# Altium schematic sheet Project_Node_Sensors.SchDoc: Principal Node_Sensor Schematic
size A; Date: 10/08/2024; Author: Prudhvi Kondapalli; CompanyName: CU Boulder; DrawnBy: Project_Vega_Team; Engineer: Prudhvi Kondapalli; DocumentNumber: 1; Revision: 1; SheetNumber: 5; SheetTotal: 7
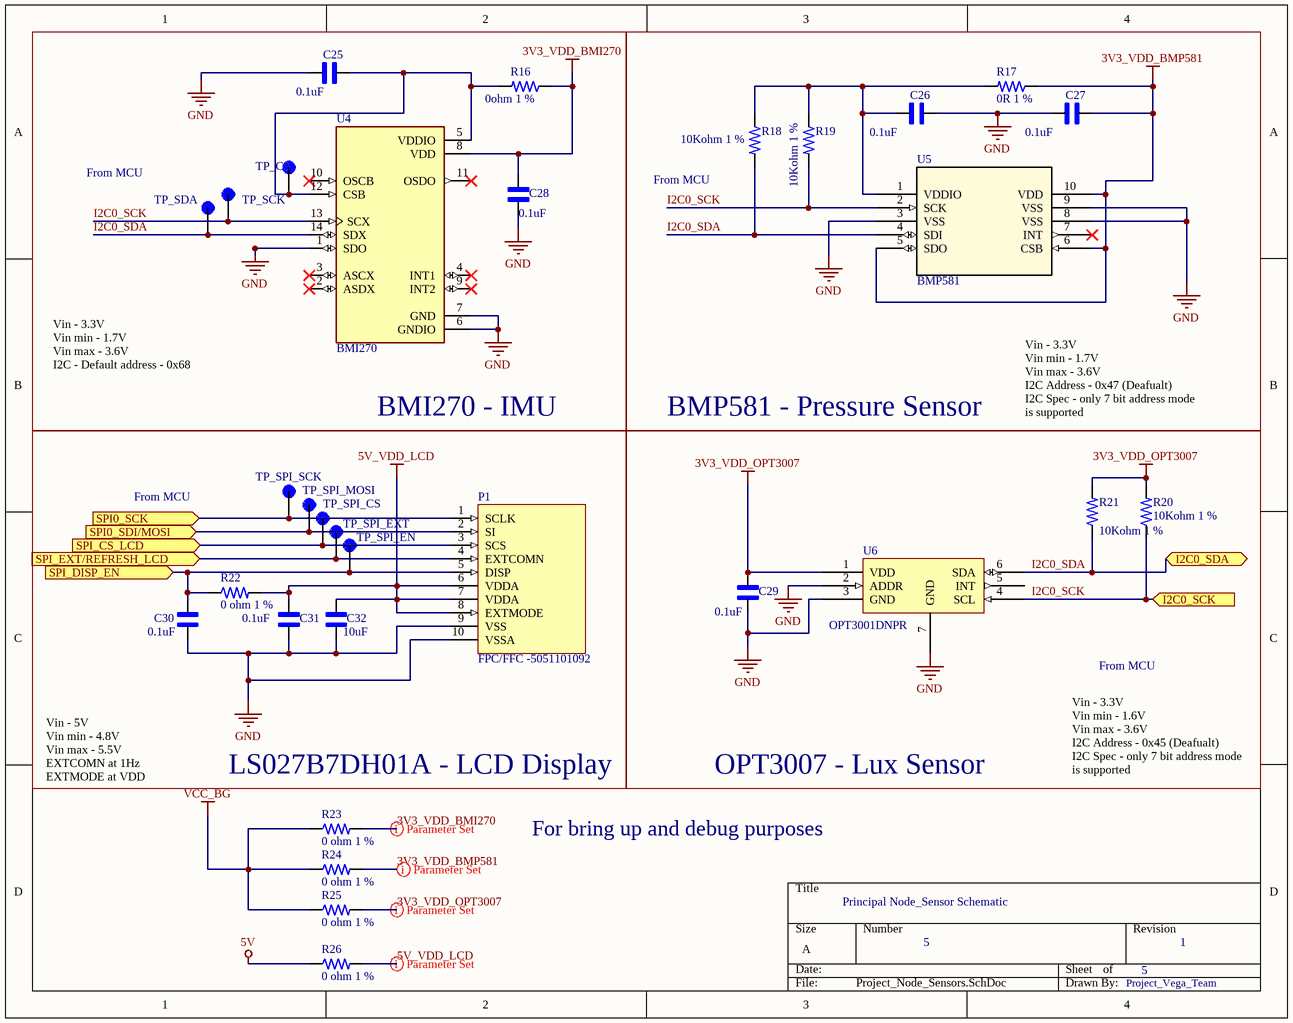
[diagram p0: Project_Node_Sensors.SchDoc]

## Parts
C25  0.1uF  [CAPC1608X90]
C26  0.1uF  [CAPC1608X90]
C27  0.1uF  [CAPC1608X90]
C28  0.1uF  [CAPC1608X90]
C29  0.1uF  [CAPC1608X90]
C30  0.1uF  [CAPC1608X90]
C31  0.1uF  [CAPC1608X90]
C32  10uF  [CAPC1608X90]
P1  FPC/FFC -5051101092  [CON_5051101092_MOL]
R16  0ohm 1 %  [RES_0603_1608X06]
R17  0R 1 %  [RES_0603_1608X06]
R18  10Kohm 1 %  [RES_0603_1608X06]
R19  10Kohm 1 %  [RES_0603_1608X06]
R20  10Kohm 1 %  [RES_0603_1608X06]
R21  10Kohm 1 %  [RES_0603_1608X06]
R22  0 ohm 1 %  [RES_0603_1608X06]
R23  0 ohm 1 %  [RES_0603_1608X06]
R24  0 ohm 1 %  [RES_0603_1608X06]
R25  0 ohm 1 %  [RES_0603_1608X06]
R26  0 ohm 1 %  [RES_0603_1608X06]
TP_CS  Test_point  [1]  (value not drawn)
TP_SCK  Test_point  [1]  (value not drawn)
TP_SDA  Test_point  [1]  (value not drawn)
TP_SPI_CS  Test_point  [1]  (value not drawn)
TP_SPI_EN  Test_point  [1]  (value not drawn)
TP_SPI_EXT  Test_point  [1]  (value not drawn)
TP_SPI_MOSI  Test_point  [1]  (value not drawn)
TP_SPI_SCK  Test_point  [1]  (value not drawn)
U4  BMI270  [XDCR_BMI270]
U5  BMP581  [QFN10_BMP581_BOS-M]
U6  OPT3001DNPR  [OPT3001-SON127P600-8N]

## Blocks framed on the sheet
BMI270 - IMU: C25 C28 R16 TP_CS TP_SCK TP_SDA U4
BMP581 - Pressure Sensor: C26 C27 R17-R19 U5

## Ports
I2C0_SCK (in, see Principal_Node[2C]), I2C0_SDA (bidir, see Principal_Node[2C]), SPI0_SCK (in, see Principal_Node[2D]), SPI0_SDI/MOSI (in, see Principal_Node[2D]), SPI_CS_LCD (in, see Principal_Node[2D]), SPI_DISP_EN (in, see Principal_Node[2C]), SPI_EXT/REFRESH_LCD (in, see Principal_Node[2C])

## Nets
3V3_VDD_BMI270: C28.1 R16.1 R23.2 U4.8(VDD)
3V3_VDD_BMP581: C27.2 R17.1 R24.2 U5.5(SDO) U5.6(CSB) U5.10(VDD)
3V3_VDD_OPT3007: C29.2 R20.2 R21.2 R25.2 U6.1(VDD)
5V: R26.1
5V_VDD_LCD: C31.2 C32.2 P1.6(VDDA) P1.7(VDDA) P1.8(EXTMODE) R22.2 R26.2
GND: C25.1 C26.2 C27.1 C28.2 C29.1 C30.1 C31.1 C32.1 P1.9(VSS) P1.10(VSSA) U4.1(SDO) U4.6(GNDIO) U4.7(GND) U5.3(VSS) U5.8(VSS) U5.9(VSS) U6.2(ADDR) U6.3(GND) U6.7(GND)
VCC_BG: R23.1 R24.1 R25.1
I2C0_SCK: R19.2 R20.1 TP_SCK.TP(I2C_SCK) U4.13(SCX) U5.2(SCK) U6.4(SCL) ; port I2C0_SCK
I2C0_SDA: R18.2 R21.1 TP_SDA.TP(I2C_SDA) U4.14(SDX) U5.4(SDI) U6.6(SDA) ; port I2C0_SDA
SPI0_SCK: P1.1(SCLK) TP_SPI_SCK.TP(SPI_SCK) ; port SPI0_SCK
SPI0_SDI/MOSI: P1.2(SI) TP_SPI_MOSI.TP(SPI_MOSI) ; port SPI0_SDI/MOSI
SPI_CS_LCD: P1.3(SCS) TP_SPI_CS.TP(SPI_CS) ; port SPI_CS_LCD
SPI_DISP_EN: C30.2 P1.5(DISP) R22.1 TP_SPI_EN.TP(SPI_EN) ; port SPI_DISP_EN
SPI_EXT/REFRESH_LCD: P1.4(EXTCOMN) TP_SPI_EXT.TP(SPI_EXT) ; port SPI_EXT/REFRESH_LCD
NetC25_2: C25.2 R16.2 TP_CS.TP(CS) U4.5(VDDIO) U4.12(CSB)
NetC26_1: C26.1 R17.2 R18.1 R19.1 U5.1(VDDIO)

Not connected (* = marked no-connect by the designer): U4 2(ASDX)* 3(ASCX)* 4(INT1)* 9(INT2)* 10(OSCB)* 11(OSDO)*; U5 7(INT)*; U6 5(INT)

## Layout directives
rule Width Constraint [Pref Width = 10mil    Min Width = 10mil    Max Width = 10mil]: 3V3_VDD_BMI270, 3V3_VDD_BMP581, 3V3_VDD_OPT3007
rule Width Constraint [Pref Width = 20mil    Min Width = 10mil    Max Width = 20mil]: 5V_VDD_LCD

## Notes on the sheet
- From MCU
- Vin - 3.3V
  Vin min - 1.7V
  Vin max - 3.6V
  I2C - Default address - 0x68
- Vin - 3.3V
  Vin min - 1.7V
  Vin max - 3.6V
  I2C Address - 0x47 (Deafualt)
  I2C Spec - only 7 bit address mode is supported
- Vin - 5V
  Vin min - 4.8V
  Vin max - 5.5V
  EXTCOMN at 1Hz
  EXTMODE at VDD
- (near R23) LS027B7DH01A - LCD Display
- OPT3007 - Lux Sensor
- Vin - 3.3V
  Vin min - 1.6V
  Vin max - 3.6V
  I2C Address - 0x45 (Deafualt)
  I2C Spec - only 7 bit address mode is supported
- For bring up and debug purposes

## Library data of the parts
C25-C32 = CC0603KRX7R9BB104: 0.1 ÂµF Â±10% 50V Ceramic Capacitor X7R 0603 (1608 Metric); MF: Yageo; SnapEDA_Link: https://www.snapeda.com/parts/CC0603KRX7R9BB104/Yageo/view-part/?ref=snap; Package: 0603 Yageo; Value: *; MP: CC0603KRX7R9BB104; Check_prices: https://www.snapeda.com/parts/CC0603KRX7R9BB104/Yageo/view-part/?ref=eda
P1 = 5051101092: Easy-On FFC/FPC Connector, 0.50mm Pitch, FD19 Series, Right-Angle, Bottom Contact, 1.90mm Height, 10 Circuits, Gold over Nickel Plating; Manufacturer: Molex; Manufacturer Part Number: 505110-1092; Actuator Material: Nylon,Glass,Polyamide; Actuator Color: Black; Number of Positions: 10; Voltage Rating: 50V; Gender: Receptacle; Mating Cycles: 25; Supplier: Digikey; Supplier Part Number: WM12366CT-ND; RoHS: Yes; Category: FFC / FPC; Stock: 64732; Pricing: 1=0.73, 10=0.545, 25=0.4884, 50=0.4514, 100=0.4185, 250=0.3808, 500=0.35616, 1000=0.33441, 3000=0.3051, 6000=0.28943, 9000=0.28114, 15000=0.27155, 21000=0.26571, 30000=0.26151 (USD); Mounting Technology: Surface Mount; Pins: 10; Contact Material: Bronze; Contact Plating: Gold; Housing Material: Polymer; Housing Color: Beige; Plating: Gold; Min Operating Temperature: -40°C; Max Operating Temperature: 105°C; Packaging: Cut Tape; Termination: Solder; Number of Rows: 1; Series: Easy-On FD19 505110; Number of Circuits: 10; Number of Contacts: 10; Orientation: Right Angle; Height: 4.15mm; Flammability Rating: UL94 V-0; RoHS Compliant: Yes; Reach SVHC Compliant: Unknown; ComponentLink1URL: http://www.farnell.com/datasheets/2215713.pdf?src-supplier=Farnell; ComponentLink1Description: http://www.farnell.com/datasheets/2215713.pdf?src-supplier=Farnell; ComponentLink2URL: https://media.digikey.com/pdf/Data%20Sheets/Molex%20PDFs/FFC-FPC_Connectors.pdf?src-supplier=Digikey; ComponentLink2Description: https://media.digikey.com/pdf/Data%20Sheets/Molex%20PDFs/FFC-FPC_Connectors.pdf?src-supplier=Digikey; ComponentLink3URL: https://www.mouser.com/ds/2/276/5051101092_FFC_FPC_CONNECTORS-772849.pdf?src-supplier=Mouser; ComponentLink3Description: https://www.mouser.com/ds/2/276/5051101092_FFC_FPC_CONNECTORS-772849.pdf?src-supplier=Mouser; ComponentLink4URL: http://www.alliedelec.com/m/d/498d8ef60ec1840486550b3bb04c7a47.pdf?src-supplier=Allied+Electronics; ComponentLink4Description: http://www.alliedelec.com/m/d/498d8ef60ec1840486550b3bb04c7a47.pdf?src-supplier=Allied+Electronics; ComponentLink5URL: https://www.molex.com/datasheets/rohspdf/5051101092_rohs.pdf?src-supplier=Digikey; ComponentLink5Description: https://www.molex.com/datasheets/rohspdf/5051101092_rohs.pdf?src-supplier=Digikey; ComponentLink6URL: https://datasheet.octopart.com/505110-1092-Molex-datasheet-62088043.pdf?src-supplier=Farnell; ComponentLink6Description: https://datasheet.octopart.com/505110-1092-Molex-datasheet-62088043.pdf?src-supplier=Farnell; ComponentLink7URL: http://www.farnell.com/datasheets/2014276.pdf?src-supplier=Element14; ComponentLink7Description: http://www.farnell.com/datasheets/2014276.pdf?src-supplier=Element14; ComponentLink8URL: http://www.farnell.com/datasheets/2215713.pdf?src-supplier=Element14; ComponentLink8Description: http://www.farnell.com/datasheets/2215713.pdf?src-supplier=Element14; ComponentLink9URL: https://datasheet.octopart.com/505110-1092-Molex-datasheet-77521069.pdf?src-supplier=Element14; ComponentLink9Description: https://datasheet.octopart.com/505110-1092-Molex-datasheet-77521069.pdf?src-supplier=Element14; ComponentLink10URL: http://www.farnell.com/datasheets/2215713.pdf?src-supplier=Newark; ComponentLink10Description: http://www.farnell.com/datasheets/2215713.pdf?src-supplier=Newark
R16-R26 = RC0603FR-07140RL: SMD Chip Resistor, 140 Ohm, ± 1%, 100 mW, 0603 [1608 Metric], Thick Film, General Purpose; Manufacturer: Yageo; Value: 140R; Power Rating: 100mW; Voltage Rating: 50V; Temperature Coefficient: 100ppm/°C; Supplier: Digikey; Supplier Part Number: 311-140HRCT-ND; Manufacturer Part Number: RC0603FR-07140RL; RoHS: Yes; Category: Chip SMD Resistors; Stock: 238807; Pricing: 1=0.1, 10=0.019, 50=0.0112, 100=0.0093, 500=0.00622, 1000=0.00532, 5000=0.00382, 10000=0.00335, 25000=0.00287, 35000=0.00278, 50000=0.00257, 125000=0.00232 (USD); Mounting Technology: Surface Mount; Case/Package: 0603; Case Code (Imperial): 0603; Case Code (Metric): 1608; Min Operating Temperature: -55°C; Max Operating Temperature: 155°C; Tolerance: 1%; Packaging: Tape and Reel; Termination: SMD/SMT; Voltage Rating (DC): 50V; Features: Moisture Resistant; Series: RC; Max Power Dissipation: 100mW; Number of Terminations: 2; Construction: Rectangular; Technology: THICK FILM; Length: 1.6mm; Height: 0.45mm; Depth: 0.8mm; Lead Free: Lead Free; RoHS Compliant: Yes; Military Standard: Not; ComponentLink1URL: https://datasheet.ciiva.com/11808/0900766b80c66297-11808828.pdf?src-supplier=Rs; ComponentLink1Description: https://datasheet.ciiva.com/11808/0900766b80c66297-11808828.pdf?src-supplier=Rs; ComponentLink2URL: https://datasheet.ciiva.com/15189/getdatasheetpartid-329205-15189606.pdf?src-supplier=Verical; ComponentLink2Description: https://datasheet.ciiva.com/15189/getdatasheetpartid-329205-15189606.pdf?src-supplier=Verical
TP_CS TP_SCK TP_SDA TP_SPI_CS TP_SPI_EN TP_SPI_EXT TP_SPI_MOSI TP_SPI_SCK = Test_point: SMT Test Point- Mininature-1000 pc Reels; MP: 5019; MF: Keystone Electronics; Value: *; Availability: In Stock; Purchase-URL: https://pricing.snapeda.com/search/part/5019/?ref=eda; Package: None; Price: None
U4 = BMI270: Accelerometer, Gyroscope, 6 Axis Sensor IÂ²C, SPI Output; MF: Bosch Sensortec; Digi-Key_Part_Number: 828-1091-2-ND; Check_prices: https://www.snapeda.com/parts/BMI270/Bosch+Sensortec/view-part/?ref=eda; MP: BMI270; Package: LGA-14 Bosch Sensortec; SnapEDA_Link: https://www.snapeda.com/parts/BMI270/Bosch+Sensortec/view-part/?ref=snap; Value: *; Purchase-URL: https://pricing.snapeda.com/search/part/BMI270/?ref=eda; Supplier 1: Digikey; Supplier Part Number 1: 828-1091-1-ND
U5 = BMP581: No Description Available; Mfr_Name: Bosch Sensortec; RefDes: RefDes; Type: Type
U6 = OPT3001DNPR: Digital ambient light sensor (ALS) with high-precision human-eye response 6-USON -40 to 85; Manufacturer: Texas Instruments; Interface: I2C; Wavelength: 550nm; Min Supply Voltage: 1.6V; Max Supply Voltage: 3.6V; Clock Frequency: 2.6MHz; Output Type: I2C,Digital; Sensing Method: Optical; Supplier: Digikey; Supplier Part Number: 296-40474-1-ND; Manufacturer Part Number: OPT3001DNPR; RoHS: Yes; Category: Integrated Circuits (ICs); Stock: 51147; Pricing: 1=2.99, 5=2.52, 10=2.342, 25=2.1248, 50=1.9744, 100=1.8347, 500=1.54766, 1000=1.43839 (USD); Mounting Technology: Surface Mount; Pins: 6; Min Operating Temperature: -40°C; Max Operating Temperature: 85°C; Packaging: Tape and Reel; Series: -; Reach SVHC Compliant: No; Lead Free: Lead Free; RoHS Compliant: Yes; ComponentLink1URL: http://www.ti.com/lit/ds/symlink/opt3001.pdf?src-supplier=Digikey; ComponentLink1Description: http://www.ti.com/lit/ds/symlink/opt3001.pdf?src-supplier=Digikey; ComponentLink2URL: http://www.ti.com/general/docs/lit/getliterature.tsp?genericPartNumber=OPT3001&amp;&amp;fileType=pdf&src-supplier=Farnell; ComponentLink2Description: http://www.ti.com/general/docs/lit/getliterature.tsp?genericPartNumber=OPT3001&amp;&amp;fileType=pdf&src-supplier=Farnell; ComponentLink3URL: http://www.ti.com/general/docs/lit/getliterature.tsp?genericPartNumber=OPT3001&&fileType=pdf&src-supplier=Avnet; ComponentLink3Description: http://www.ti.com/general/docs/lit/getliterature.tsp?genericPartNumber=OPT3001&&fileType=pdf&src-supplier=Avnet; ComponentLink4URL: http://www.ti.com/general/docs/lit/getliterature.tsp?genericPartNumber=OPT3001&&fileType=pdf&src-supplier=Element14; ComponentLink4Description: http://www.ti.com/general/docs/lit/getliterature.tsp?genericPartNumber=OPT3001&&fileType=pdf&src-supplier=Element14